# EAGLE design MinSys MCS51 (EAGLE 7.2.0)
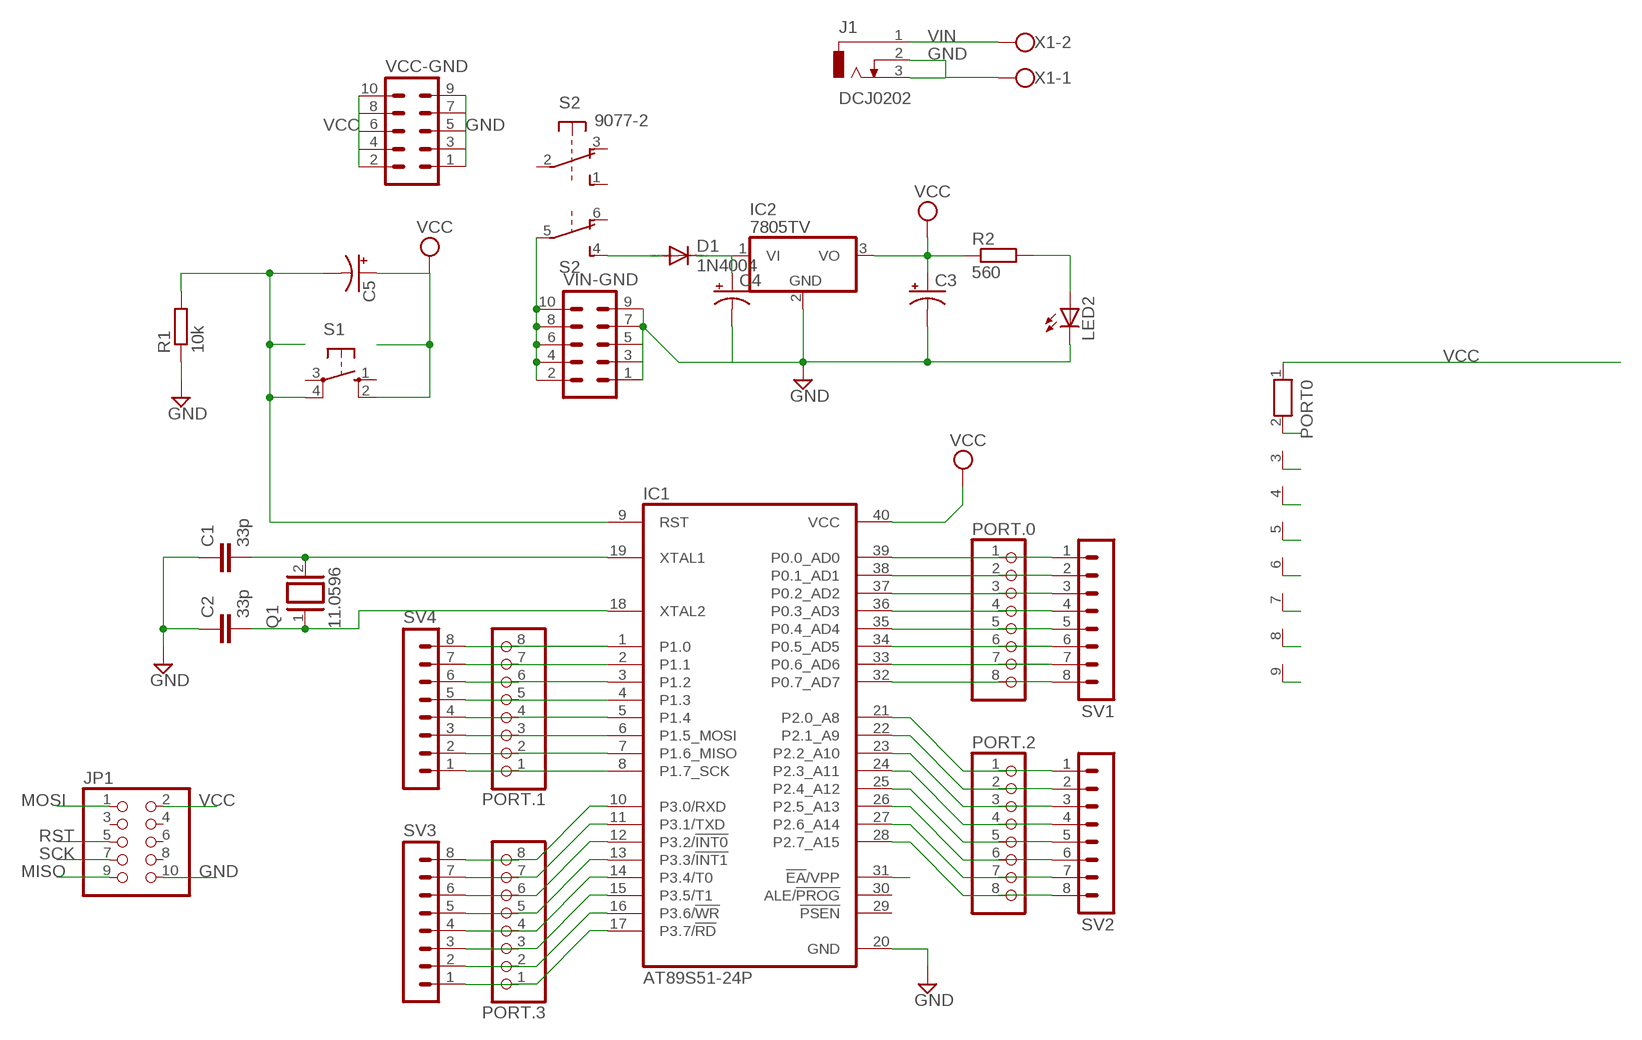
[diagram p0: schematic, sheet 1]

## Parts
C1  33p  C2,5-3  [C2.5-3]
C2  33p  C2,5-3  [C2.5-3]
C3  CPOL-USE2,5-6E  [E2,5-6E]
C4  CPOL-USE2,5-6E  [E2,5-6E]
C5  CPOL-USE2.5-6  [E2,5-6]
D1  1N4004  [DO41-10]
IC1  AT89S51-24P  [DIL40]
IC2  7805TV  [TO220V]
J1  DCJ0202  [DCJ0202]
JP1  PINHD-2X5  [2X05]
LED2  LED3MM  [LED3MM]
PORT0  RN08  [RN-9]
PORT.0  PINHD-1X8  [1X08]
PORT.1  PINHD-1X8  [1X08]
PORT.2  PINHD-1X8  [1X08]
PORT.3  PINHD-1X8  [1X08]
Q1  11.0596  XTAL/S  [QS]
R1  10k  R-EU_0207/10  [0207/10]
R2  560  R-EU_0207/10  [0207/10]
S1  10-XX  [B3F-10XX]
S2  9077-2  [9077-2]
SV1  MA08-1  [MA08-1]
SV2  MA08-1  [MA08-1]
SV3  MA08-1  [MA08-1]
SV4  MA08-1  [MA08-1]
VCC-GND  MA05-2  [MA05-2]
VIN-GND  MA05-2  [MA05-2]
X1  W237-102  [W237-102]

## Nets
GND: C1.1 C2.1 C3.- C4.- IC1.20(GND) IC2.2(GND) J1.2 J1.3 JP1.10 LED2.K(C) R1.1 VCC-GND.1 VCC-GND.3 VCC-GND.5 VCC-GND.7 VCC-GND.9 VIN-GND.1 VIN-GND.3 VIN-GND.5 VIN-GND.7 VIN-GND.9 X1.1
MISO: IC1.7(P1.6_MISO) JP1.9 PORT.1.2 SV4.2
MOSI: IC1.6(P1.5_MOSI) JP1.1 PORT.1.3 SV4.3
N$2: D1.A S2.4(2:S)
N$9: C1.2 IC1.19(XTAL1) Q1.2
N$10: C2.2 IC1.18(XTAL2) Q1.1
N$36: C4.+ D1.C IC2.1(VI)
N$41: LED2.A R2.2
P00: IC1.39(P0.0_AD0) PORT0.2 PORT.0.1 SV1.1
P01: IC1.38(P0.1_AD1) PORT0.3 PORT.0.2 SV1.2
P02: IC1.37(P0.2_AD2) PORT0.4 PORT.0.3 SV1.3
P03: IC1.36(P0.3_AD3) PORT0.5 PORT.0.4 SV1.4
P04: IC1.35(P0.4_AD4) PORT0.6 PORT.0.5 SV1.5
P05: IC1.34(P0.5_AD5) PORT0.7 PORT.0.6 SV1.6
P06: IC1.33(P0.6_AD6) PORT0.8 PORT.0.7 SV1.7
P07: IC1.32(P0.7_AD7) PORT0.9 PORT.0.8 SV1.8
P10: IC1.1(P1.0) PORT.1.8 SV4.8
P11: IC1.2(P1.1) PORT.1.7 SV4.7
P12: IC1.3(P1.2) PORT.1.6 SV4.6
P13: IC1.4(P1.3) PORT.1.5 SV4.5
P14: IC1.5(P1.4) PORT.1.4 SV4.4
P20: IC1.21(P2.0_A8) PORT.2.1 SV2.1
P21: IC1.22(P2.1_A9) PORT.2.2 SV2.2
P22: IC1.23(P2.2_A10) PORT.2.3 SV2.3
P23: IC1.24(P2.3_A11) PORT.2.4 SV2.4
P24: IC1.25(P2.4_A12) PORT.2.5 SV2.5
P25: IC1.26(P2.5_A13) PORT.2.6 SV2.6
P26: IC1.27(P2.6_A14) PORT.2.7 SV2.7
P27: IC1.28(P2.7_A15) PORT.2.8 SV2.8
P30: IC1.10(P3.0/RXD) PORT.3.8 SV3.8
P31: IC1.11(P3.1/TXD) PORT.3.7 SV3.7
P32: IC1.12(P3.2/!INT0) PORT.3.6 SV3.6
P33: IC1.13(P3.3/!INT1) PORT.3.5 SV3.5
P34: IC1.14(P3.4/T0) PORT.3.4 SV3.4
P35: IC1.15(P3.5/T1) PORT.3.3 SV3.3
P36: IC1.16(P3.6/!WR) PORT.3.2 SV3.2
P37: IC1.17(P3.7/!RD) PORT.3.1 SV3.1
RST: C5.- IC1.9(RST) JP1.5 R1.2 S1.4(P1)
SCK: IC1.8(P1.7_SCK) JP1.7 PORT.1.1 SV4.1
VCC: C3.+ C5.+ IC1.31(!EA!/VPP) IC1.40(VCC) IC2.3(VO) JP1.2 PORT0.1 R2.1 S1.2(S1) VCC-GND.2 VCC-GND.4 VCC-GND.6 VCC-GND.8 VCC-GND.10
VIN: J1.1 S2.5(2:P) VIN-GND.2 VIN-GND.4 VIN-GND.6 VIN-GND.8 VIN-GND.10 X1.2
Unconnected: IC1.29(!PSEN) IC1.30(ALE/!PROG) JP1.3 JP1.4 JP1.6 JP1.8 S1.1(S) S1.3(P) S2.1(1:S) S2.2(1:P) S2.3(1:O) S2.6(2:O)

## Library data of the parts
C1 C2 = capacitor-wima:C: CAPACITOR naming: grid - package width
C3-C5 = rcl:CPOL-US: POLARIZED CAPACITOR, American symbol
D1 = diode:1N4004: DIODE general purpose rectifier, 1 A
IC1 = atmel:AT89S51-*: 8-bit Microcontroller with 4K BytesIn-System Programmable Flash Source: http://www.atmel.com/dyn/resources/prod_documents/doc2487.pdf; MPN: AT89S51-24PU; OC_FARNELL: 1095739; OC_NEWARK: 96K6578
IC2 = linear:78*: Positive VOLTAGE REGULATOR Source: http://cache.national.com/ds/LM/LM78L05.pdf http://www.fairchildsemi.com/ds/LM/LM7805.pdf
J1 = con-jack:DCJ0202: DC POWER JACK Source: DCJ0202.pdf; OC_FARNELL: unknown; OC_NEWARK: unknown
JP1 = pinhead:PINHD-2X5: PIN HEADER
LED2 = led:LED: LED OSRAM: - CHIPLED LG R971, LG N971, LY N971, LG Q971, LY Q971, LO R971, LY R971 LH N974, LH R974 LS Q976, LO Q976, LY Q976 LO Q996 - Hyper CHIPLED LW Q18S LB Q993, LB Q99A, LB R99A - SideLED LS A670, LO A670, LY A670, LG A670, LP A670 LB A673, LV A673, LT A673, LW A673 LH A674 LY A675 LS A676, LA A676, LO A676, LY A676, LW A676 LS A679, LY A679, LG A679 - Hyper Micro SIDELED® LS Y876, LA Y876, LO Y876, LY Y876 LT Y87S - SmartLED LW L88C, LW L88S LB L89C, LB L89S, LG L890 LS L89K, LO L89K, LY L89K LS L896, LA L896, LO L896, LY L896 - TOPLED LS T670, LO T670, LY T670, LG T670, LP T670 LSG T670, LSP T670, LSY T670, LOP T670, LYG T670 LG T671, LOG T671, LSG T671 LB T673, LV T673, LT T673, LW T673 LH T674 LS T676, LA T676, LO T676, LY T676, LB T676, LH T676, LSB T676, LW T676 LB T67C, LV T67C, LT T67C, LS T67K, LO T67K, LY T67K, LW E67C LS E67B, LA E67B, LO E67B, LY E67B, LB E67C, LV E67C, LT E67C LW T67C LS T679, LY T679, LG T679 LS T770, LO T770, LY T770, LG T770, LP T770 LB T773, LV T773, LT T773, LW T773 LH T774 LS E675, LA E675, LY E675, LS T675 LS T776, LA T776, LO T776, LY T776, LB T776 LHGB T686 LT T68C, LB T68C - Hyper Mini TOPLED® LB M676 - Mini TOPLED Santana® LG M470 LS M47K, LO M47K, LY M47K Source: http://www.osram.convergy.de LUXEON: - LUMILED® LXK2-PW12-R00, LXK2-PW12-S00, LXK2-PW14-U00, LXK2-PW14-V00 LXK2-PM12-R00, LXK2-PM12-S00, LXK2-PM14-U00 LXK2-PE12-Q00, LXK2-PE12-R00, LXK2-PE12-S00, LXK2-PE14-T00, LXK2-PE14-U00 LXK2-PB12-K00, LXK2-PB12-L00, LXK2-PB12-M00, LXK2-PB14-N00, LXK2-PB14-P00, LXK2-PB14-Q00 LXK2-PR12-L00, LXK2-PR12-M00, LXK2-PR14-Q00, LXK2-PR14-R00 LXK2-PD12-Q00, LXK2-PD12-R00, LXK2-PD12-S00 LXK2-PH12-R00, LXK2-PH12-S00 LXK2-PL12-P00, LXK2-PL12-Q00, LXK2-PL12-R00 Source: www.luxeon.com KINGBRIGHT: KA-3528ASYC Source: www.kingbright.com
PORT0 = resistor-net:RN08: RESISTOR NETWORK; OC_FARNELL: unknown; OC_NEWARK: unknown
PORT.0 PORT.1-PORT.3 = pinhead:PINHD-1X8: PIN HEADER
Q1 = special:XTAL/S: CRYSTAL
R1 = rcl:R-EU_: RESISTOR, European symbol
R2 = resistor:R-EU_: RESISTOR, European symbol
S1 = switch-omron:10-XX: OMRON SWITCH; MPN: B3F-1000; OC_FARNELL: 176432; OC_NEWARK: 36M3542
S2 = switch-misc:9077-2: MARQUARDT SWITCH 9077.0200 Distributor: Buerklin <https://www.buerklin.com/default.asp?event=ShowArtikel%2812G2822%29&l=d&jump=ArtNr_12G2822>
SV1-SV4 = con-lstb:MA08-1: PIN HEADER; OC_FARNELL: unknown; OC_NEWARK: unknown
VCC-GND VIN-GND = con-lstb:MA05-2: PIN HEADER; OC_FARNELL: unknown; OC_NEWARK: unknown
X1 = con-wago-500:W237-102: WAGO SCREW CLAMP; MPN: 237-102; OC_FARNELL: unknown; OC_NEWARK: 70K9898

## Board
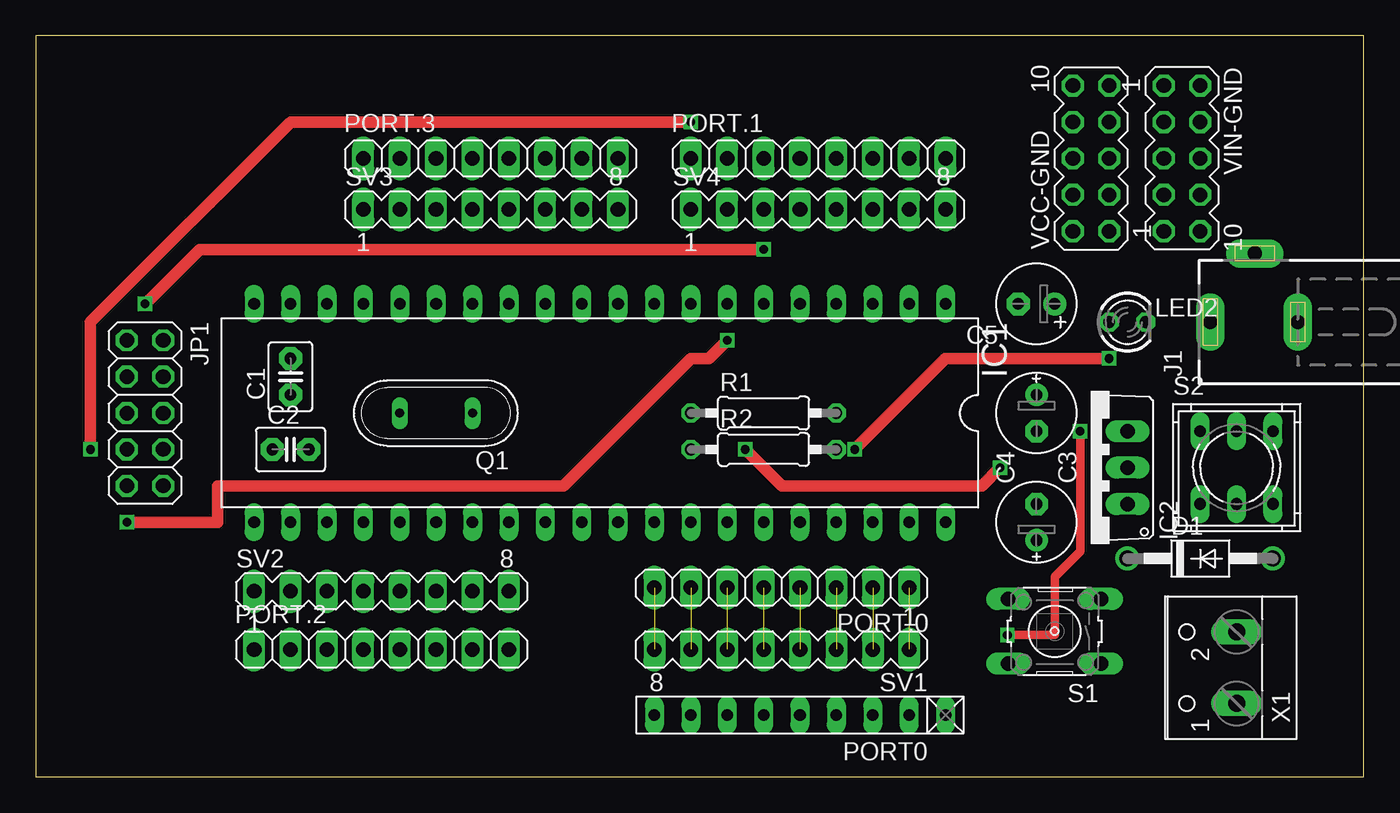
[diagram p1: board, top side]
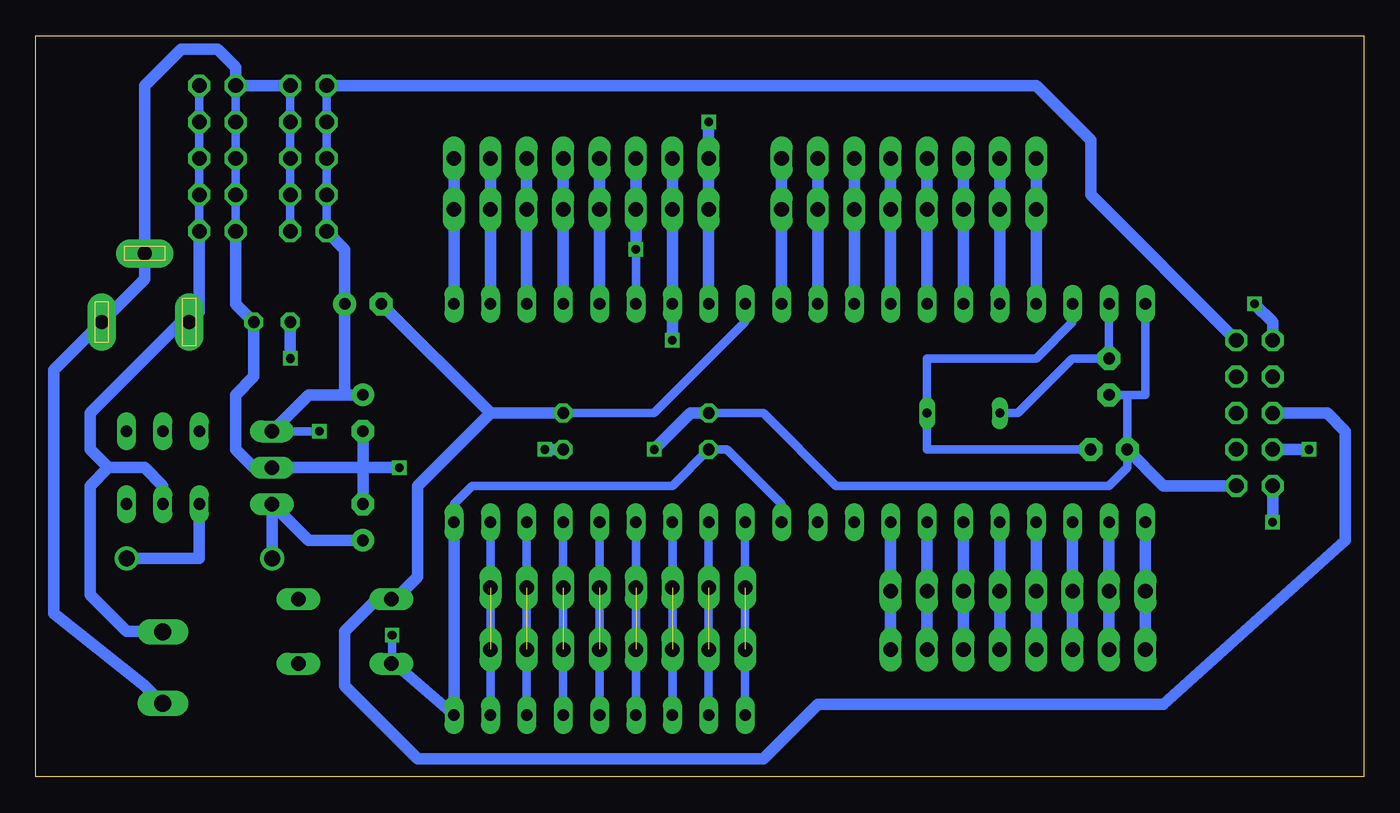
[diagram p2: board, bottom side, seen from below]

Size 92.69 x 51.74 mm. Coordinates in mm from the lower left corner, seen from the top.
Outline: 0,0 92.69,0 92.69,51.74 0,51.74 0,0
Copper layers (1*16): Top 0.035mm / dielectric 1.5mm / Bottom 0.035mm
Design rules "default": minimum track width 10mil, minimum drill 24mil, track to track 8mil, track to pad 8mil, pad to pad 8mil, via to via 8mil, smd to smd 8mil, copper to edge 40mil, drill to drill 8mil, minimum pad ring 10mil, minimum via ring 8mil, stop-mask expansion 4mil, vias tented up to drill 0mil, thermal gap 10mil

### Footprints (pad centres in the part's own frame; a part is rotated, then mirrored left to right if it is on the bottom)
C2.5-3 = drill 0.813 pad 1.6 octagon: 1 -1.27,0; 2 1.27,0
E2,5-6E = drill 0.813 pad 1.575: + -1.27,0 | drill 0.813 pad 1.575 octagon: - 1.27,0
E2,5-6 = drill 0.813 pad 1.6: + -1.27,0 | drill 0.813 pad 1.6 octagon: - 1.27,0
DO41-10 = drill 1.118: A 5.08,0; C -5.08,0
DIL40 = drill 0.813 long: 1 -24.13,-7.62; 2 -21.59,-7.62; 3 -19.05,-7.62; 4 -16.51,-7.62; 5 -13.97,-7.62; 6 -11.43,-7.62; 7 -8.89,-7.62; 8 -6.35,-7.62; 9 -3.81,-7.62; 10 -1.27,-7.62; 11 1.27,-7.62; 12 3.81,-7.62; 13 6.35,-7.62; 14 8.89,-7.62; 15 11.43,-7.62; 16 13.97,-7.62; 17 16.51,-7.62; 18 19.05,-7.62; 19 21.59,-7.62; 20 24.13,-7.62; 21 24.13,7.62; 22 21.59,7.62; 23 19.05,7.62; 24 16.51,7.62; 25 13.97,7.62; 26 11.43,7.62; 27 8.89,7.62; 28 6.35,7.62; 29 3.81,7.62; 30 1.27,7.62; 31 -1.27,7.62; 32 -3.81,7.62; 33 -6.35,7.62; 34 -8.89,7.62; 35 -11.43,7.62; 36 -13.97,7.62; 37 -16.51,7.62; 38 -19.05,7.62; 39 -21.59,7.62; 40 -24.13,7.62
TO220V = drill 1.016 long: 1 -2.54,-2.54; 2 0,-2.54; 3 2.54,-2.54
DCJ0202 = drill 1 pad 2 long: 1 0,3.1; 2 4.8,0; 3 0,-3
2X05 = drill 1.016 octagon: 1 -5.08,-1.27; 2 -5.08,1.27; 3 -2.54,-1.27; 4 -2.54,1.27; 5 0,-1.27; 6 0,1.27; 7 2.54,-1.27; 8 2.54,1.27; 9 5.08,-1.27; 10 5.08,1.27
LED3MM = drill 0.813 octagon: A -1.27,0; K 1.27,0
RN-9 = drill 0.813 long: 1 -10.16,0; 2 -7.62,0; 3 -5.08,0; 4 -2.54,0; 5 0,0; 6 2.54,0; 7 5.08,0; 8 7.62,0; 9 10.16,0
1X08 = drill 1.016 long: 1 -8.89,0; 2 -6.35,0; 3 -3.81,0; 4 -1.27,0; 5 1.27,0; 6 3.81,0; 7 6.35,0; 8 8.89,0
QS = drill 0.61 long: 1 -2.54,0; 2 2.54,0
0207/10 = drill 0.813 octagon: 1 -5.08,0; 2 5.08,0
B3F-10XX = drill 1.016 long: 1 -3.251,2.261; 2 3.251,2.261; 3 -3.251,-2.261; 4 3.251,-2.261
9077-2 = drill 0.813 long: 1 -2.54,2.54; 2 0,2.54; 3 2.54,2.54; 4 -2.54,-2.54; 5 0,-2.54; 6 2.54,-2.54
MA08-1 = drill 1.016 long: 1 -8.89,0; 2 -6.35,0; 3 -3.81,0; 4 -1.27,0; 5 1.27,0; 6 3.81,0; 7 6.35,0; 8 8.89,0
MA05-2 = drill 1.016 octagon: 1 -5.08,-1.27; 2 -5.08,1.27; 3 -2.54,-1.27; 4 -2.54,1.27; 5 0,-1.27; 6 0,1.27; 7 2.54,-1.27; 8 2.54,1.27; 9 5.08,-1.27; 10 5.08,1.27
W237-102 = drill 1.194 long: 1 -2.5,-1.27; 2 2.5,-1.27

### Placement (x,y rotation side)
C1  17.78,27.94 90 top
C2  17.78,22.86 0 top
C3  69.85,25.4 270 top
C4  69.85,17.78 90 top
C5  69.85,33.02 180 top
D1  81.28,15.24 0 top
IC1  39.37,25.4 180 top
IC2  73.66,21.59 90 top
J1  85.09,31.75 90 top
JP1  7.62,25.4 270 top
LED2  76.2,31.75 0 top
PORT0  53.34,4.32 180 top
PORT.0  52.07,13.21 180 top
PORT.1  54.61,43.18 0 top
PORT.2  24.13,8.89 0 top
PORT.3  31.75,43.18 0 top
Q1  27.94,25.4 180 top
R1  50.8,25.4 0 top
R2  50.8,22.86 0 top
S1  71.12,10.16 180 top
S2  83.82,21.59 0 top
SV1  52.07,8.89 180 top
SV2  24.13,12.95 0 top
SV3  31.75,39.62 0 top
SV4  54.61,39.62 0 top
VCC-GND  73.66,43.18 90 top
VIN-GND  80.01,43.18 270 top
X1  82.55,7.62 90 top

### Tracks (layer width: path | path; a pad name or v marks a point on that pad's centre or on a via)
GND  (via drill 0.6)
  Top 0.813: v49.53,22.86 52.07,20.32 66.04,20.32 v67.31,21.59
  Bottom 0.61: IC1.20 15.24,26.67 16.51,26.67 | 16.51,26.67 C1.1 | 16.51,26.67 C2.1 16.51,21.59 17.78,20.32 36.83,20.32 41.91,25.4 R1.1 | VIN-GND.1 VIN-GND.3 VIN-GND.5 VIN-GND.7 VIN-GND.9 | VCC-GND.9 VCC-GND.7 VCC-GND.5 VCC-GND.3 VCC-GND.1
  Bottom 0.813: C3.- 69.85,21.59 | 69.85,21.59 C4.- | 69.85,21.59 IC2.2 77.47,21.59 78.74,22.86 78.74,26.67 77.47,27.94 LED2.K 78.74,33.02 VIN-GND.9 | X1.1 85.13,6.39 91.44,11.43 91.44,28.4 J1.3 85.09,34.75 J1.2 85.09,48.26 82.55,50.8 80.01,50.8 78.74,49.53 VIN-GND.1 VCC-GND.9 | C2.1 13.97,20.32 JP1.10 | R1.1 46.99,25.4 v49.53,22.86 | v67.31,21.59 69.85,21.59
MISO  (via drill 0.6)
  Top 0.813: v6.35,17.78 12.7,17.78 12.7,20.32 36.83,20.32 45.72,29.21 46.99,29.21 v48.26,30.48
  Bottom 0.813: v48.26,30.48 IC1.7 SV4.2 PORT.1.2 | JP1.9 v6.35,17.78
MOSI  (via drill 0.6)
  Top 0.813: v7.62,33.02 11.43,36.83 v50.8,36.83
  Bottom 0.61: v50.8,36.83 IC1.6
  Bottom 0.813: v7.62,33.02 6.35,31.75 JP1.1 | PORT.1.3 SV4.3 v50.8,36.83
N$2
  Bottom 0.813: S2.4 81.28,15.24 D1.A
N$9
  Bottom 0.61: IC1.19 C1.2 20.32,29.21 24.13,25.4 Q1.2
N$10
  Bottom 0.61: C2.2 30.48,22.86 Q1.1 30.48,29.21 22.86,29.21 20.32,31.75 IC1.18
N$36
  Bottom 0.813: C4.+ 73.66,16.51 IC2.1 D1.C
N$41  (via drill 0.6)
  Top 0.813: v57.15,22.86 63.5,29.21 v74.93,29.21
  Bottom 0.813: R2.2 v57.15,22.86 | v74.93,29.21 LED2.A
P00  (1 unrouted)
  Bottom 0.61: IC1.39 PORT.0.1 PORT0.2
P01  (1 unrouted)
  Bottom 0.61: PORT0.3 PORT.0.2 IC1.38
P02  (1 unrouted)
  Bottom 0.61: IC1.37 PORT.0.3 PORT0.4
P03  (1 unrouted)
  Bottom 0.61: PORT0.5 PORT.0.4 IC1.36
P04  (1 unrouted)
  Bottom 0.61: IC1.35 PORT.0.5 PORT0.6
P05  (1 unrouted)
  Bottom 0.61: PORT0.7 PORT.0.6 IC1.34
P06  (1 unrouted)
  Bottom 0.61: IC1.33 PORT.0.7 PORT0.8
P07  (1 unrouted)
  Bottom 0.61: PORT0.9 PORT.0.8 IC1.32
P10
  Bottom 0.813: IC1.1 SV4.8 PORT.1.8
P11
  Bottom 0.813: PORT.1.7 SV4.7 IC1.2
P12
  Bottom 0.813: IC1.3 SV4.6 PORT.1.6
P13
  Bottom 0.813: PORT.1.5 SV4.5 IC1.4
P14
  Bottom 0.813: IC1.5 SV4.4 PORT.1.4
P20
  Bottom 0.813: IC1.21 SV2.1 PORT.2.1
P21
  Bottom 0.813: PORT.2.2 SV2.2 IC1.22
P22
  Bottom 0.813: IC1.23 SV2.3 PORT.2.3
P23
  Bottom 0.813: PORT.2.4 SV2.4 IC1.24
P24
  Bottom 0.813: IC1.25 SV2.5 PORT.2.5
P25
  Bottom 0.813: PORT.2.6 SV2.6 IC1.26
P26
  Bottom 0.813: IC1.27 SV2.7 PORT.2.7
P27
  Bottom 0.813: PORT.2.8 SV2.8 IC1.28
P30
  Bottom 0.813: IC1.10 SV3.8 PORT.3.8
P31
  Bottom 0.813: PORT.3.7 SV3.7 IC1.11
P32
  Bottom 0.813: IC1.12 SV3.6 PORT.3.6
P33
  Bottom 0.813: PORT.3.5 SV3.5 IC1.13
P34
  Bottom 0.813: IC1.14 SV3.4 PORT.3.4
P35
  Bottom 0.813: PORT.3.3 SV3.3 IC1.15
P36
  Bottom 0.813: IC1.16 SV3.2 PORT.3.2
P37
  Bottom 0.813: PORT.3.1 SV3.1 IC1.17
RST
  Bottom 0.61: IC1.9 43.18,31.75 49.53,25.4 R1.2
  Bottom 0.813: R1.2 60.96,25.4 | 60.96,25.4 C5.- | 60.96,25.4 66.04,20.32 66.04,13.97 67.59,12.42 S1.4 68.15,12.7 68.58,12.7 71.12,10.16 71.12,6.35 66.04,1.27 41.91,1.27 38.1,5.08 13.97,5.08 1.27,16.51 1.27,24.13 2.54,25.4 JP1.5
SCK  (via drill 0.6)
  Top 0.813: v3.81,22.86 3.81,31.75 17.78,45.72 v45.72,45.72
  Bottom 0.813: v45.72,45.72 PORT.1.1 SV4.1 IC1.8 | v3.81,22.86 JP1.7
VCC  (via drill 0.6)
  Top 0.61: v67.82,9.91 71.12,9.91 71.12,13.97 72.9,15.75 v72.9,24.13
  Bottom 0.61: VCC-GND.10 VCC-GND.8 VCC-GND.6 VCC-GND.4 VCC-GND.2 | IC1.31 40.64,19.05 44.45,22.86 R2.1 48.26,20.32 62.23,20.32 63.5,19.05 IC1.40 | 67.31,7.62 67.82,7.62 v67.82,9.91 | v72.9,24.13 IC2.3
  Bottom 0.813: S1.2 67.59,7.62 67.31,7.62 PORT0.1 IC1.40 | 71.12,26.67 73.66,26.67 IC2.3 | 71.12,26.67 C5.+ 71.12,36.83 VCC-GND.2 | C3.+ 71.12,26.67 | JP1.2 19.05,40.64 19.05,44.45 22.86,48.26 VCC-GND.10
VIN
  Bottom 0.61: VIN-GND.2 VIN-GND.4 VIN-GND.6 VIN-GND.8 VIN-GND.10
  Bottom 0.813: S2.5 83.82,20.32 85.09,21.59 87.63,21.59 | 87.63,21.59 88.9,20.32 88.9,12.7 86.36,10.16 83.86,10.16 X1.2 | 87.63,21.59 88.9,22.86 88.9,25.4 82.55,31.75 J1.1 81.28,32.46 VIN-GND.10